# Altium schematic sheet Block Diagram.SchDoc
size 406 x 304 mm; SheetNumber: 2; SheetTotal: 10
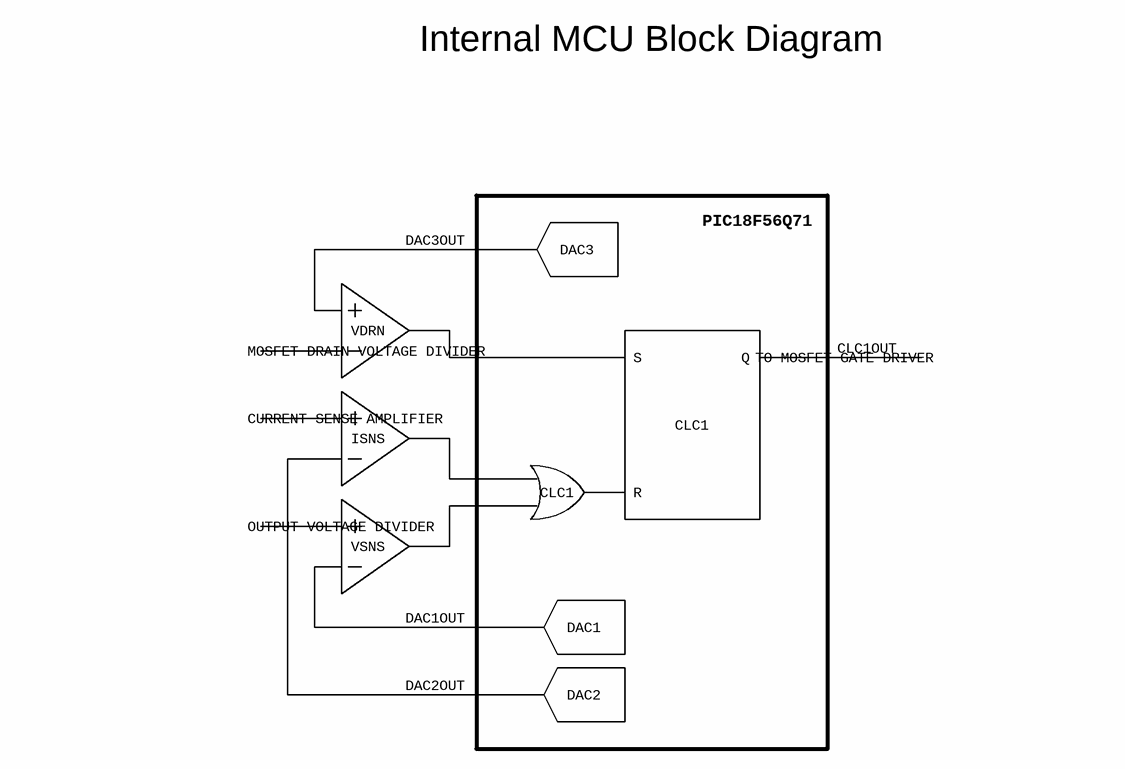
[diagram p0: Block Diagram.SchDoc]

## Notes on the sheet
- Internal MCU Block Diagram
- PIC18F56Q71
- DAC3OUT
- DAC3
- MOSFET DRAIN VOLTAGE DIVIDER
- VDRN
- S
- Q
- CLC1OUT
- TO MOSFET GATE DRIVER
- CURRENT SENSE AMPLIFIER
- CLC1
- ISNS
- R
- OUTPUT VOLTAGE DIVIDER
- VSNS
- DAC1OUT
- DAC1
- DAC2OUT
- DAC2
- Sheet Name:
- Date:
- Sheet
- Designer:
- of